# Altium schematic sheet Supply.SchDoc: Title (part 1 of 3)
size A4; Author: Adam Mizerkiewicz; CompanyName: Adam Mizerkiewicz; DrawnBy: Adam Mizerkiewicz; Engineer: Adam Mizerkiewicz; Organization: Adam Mizerkiewicz; Address1: Sarnia 2/19; Address2: 61-058 Poznań; Revision: 0.0; SheetNumber: 3; SheetTotal: 17
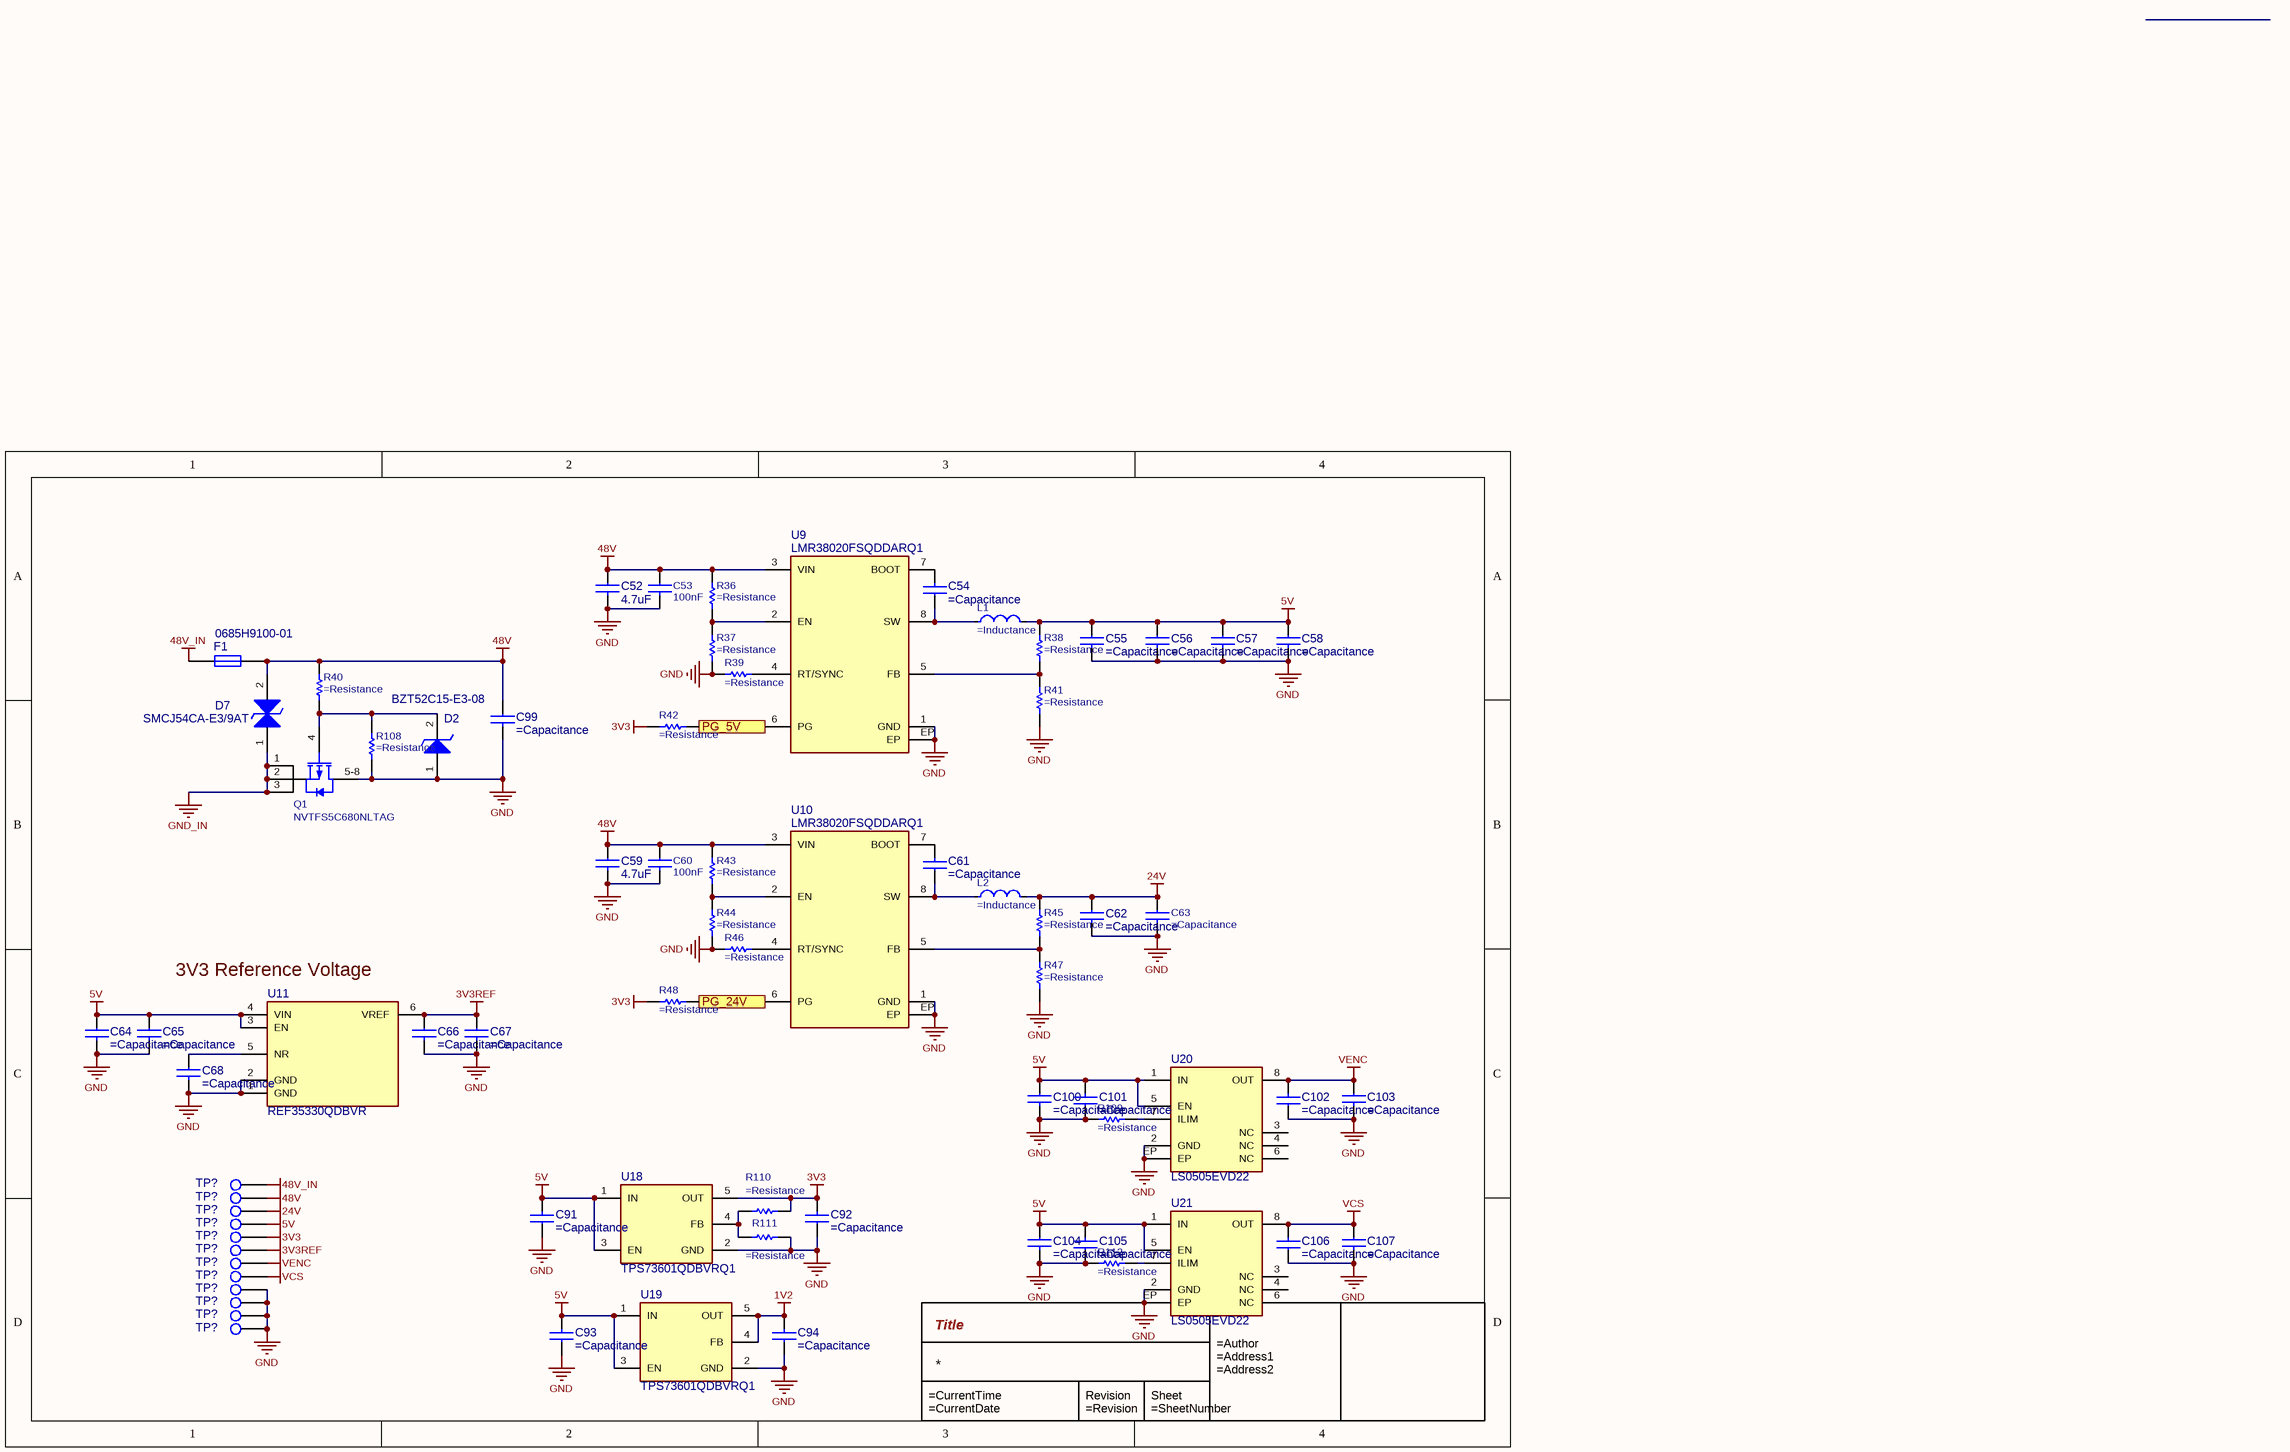
[diagram p0: Supply.SchDoc]

## Parts
(Parts that share a designator on the sheet are numbered #1, #2 ... from top to bottom, then left to right.)
C52  4.7uF  [C1206]
C53  100nF  [C0603]
C54  (no value)  [C0402]
C55  (no value)  [C0402]
C56  (no value)  [C0402]
C57  (no value)  [C0402]
C58  (no value)  [C0402]
C59  4.7uF  [C1206]
C60  100nF  [C0603]
C61  (no value)  [C0402]
C62  (no value)  [C0402]
C63  (no value)  [C0805]
C64  (no value)  [C0402]
C65  (no value)  [C0402]
C66  (no value)  [C0402]
C67  (no value)  [C0402]
C68  (no value)  [C0402]
C91  (no value)  [C0402]
C92  (no value)  [C0402]
C93  (no value)  [C0402]
C94  (no value)  [C0402]
C99  (no value)  [C1206]
C100  (no value)  [C0402]
C101  (no value)  [C0402]
C102  (no value)  [C0402]
C103  (no value)  [C0402]
C104  (no value)  [C0402]
C105  (no value)  [C0402]
C106  (no value)  [C0402]
C107  (no value)  [C0402]
D2  BZT52C15-E3-08  [SOD-123]
D7  SMCJ54CA-E3/9AT  [SMCJ_UNIPOLAR]
F1  0685H9100-01  [FUSE1206]
L1  (no value)  [ETQP4MxxxYFP]
L2  (no value)  [ETQP5MxxxYFM]
Q1  NVTFS5C680NLTAG  [WDFN8]
R36  (no value)  [R0402]
R37  (no value)  [R0402]
R38  (no value)  [R0402]
R39  (no value)  [R0402]
R40  (no value)  [R0402]
R41  (no value)  [R0402]
R42  (no value)  [R0402]
R43  (no value)  [R0402]
R44  (no value)  [R0402]
R45  (no value)  [R0402]
R46  (no value)  [R0402]
R47  (no value)  [R0402]
R48  (no value)  [R0402]
R108  (no value)  [R0402]
R109  (no value)  [R0402]
R110  (no value)  [R0402]
R111  (no value)  [R0402]
R112  (no value)  [R0402]
TP?#1  TP_SMT  [TP_SMT]  (value not drawn)  (no BOM)
TP?#2  TP_SMT  [TP_SMT]  (value not drawn)  (no BOM)
TP?#3  TP_SMT  [TP_SMT]  (value not drawn)  (no BOM)
TP?#4  TP_SMT  [TP_SMT]  (value not drawn)  (no BOM)
TP?#5  TP_SMT  [TP_SMT]  (value not drawn)  (no BOM)
TP?#6  TP_SMT  [TP_SMT]  (value not drawn)  (no BOM)
TP?#7  TP_SMT  [TP_SMT]  (value not drawn)  (no BOM)
TP?#8  TP_SMT  [TP_SMT]  (value not drawn)  (no BOM)
TP?#9  TP_SMT  [TP_SMT]  (value not drawn)  (no BOM)
TP?#10  TP_SMT  [TP_SMT]  (value not drawn)  (no BOM)
TP?#11  TP_SMT  [TP_SMT]  (value not drawn)  (no BOM)
TP?#12  TP_SMT  [TP_SMT]  (value not drawn)  (no BOM)
U9  LMR38020FSQDDARQ1  [SOIC8_PAD]
U10  LMR38020FSQDDARQ1  [SOIC8_PAD]
U11  REF35330QDBVR  [SOT-23-6]
U18  TPS73601QDBVRQ1  [SOT-23-5]
U19  TPS73601QDBVRQ1  [SOT-23-5]
U20  LS0505EVD22  [DFN2x2_8L]
U21  LS0505EVD22  [DFN2x2_8L]

## Ports
PG_5V (out), PG_24V (out)

## Nets
1V2: C94.2 U19.4(FB) U19.5(OUT)
3V3: C92.2 R42.2 R48.2 R110.2 TP?#5.1 U18.5(OUT)
3V3REF: C66.1 C67.1 TP?#6.1 U11.6(VREF)
5V: C55.1 C56.1 C57.1 C58.1 C64.1 C65.1 C91.2 C93.2 C100.1 C101.2 C104.1 C105.2 L1.2 R38.2 TP?#4.1 U11.3(EN) U11.4(VIN) U18.1(IN) U18.3(EN) U19.1(IN) U19.3(EN) U20.1(IN) U20.5(EN) U21.1(IN) U21.5(EN)
24V: C62.1 C63.1 L2.2 R45.2 TP?#3.1
48V: C52.1 C53.1 C59.1 C60.1 C99.1 D7.2 F1.1 R36.2 R40.2 R43.2 TP?#2.1 U9.3(VIN) U10.3(VIN)
48V_IN: F1.2 TP?#1.1
GND: C52.2 C53.2 C55.2 C56.2 C57.2 C58.2 C59.2 C60.2 C62.2 C63.2 C64.2 C65.2 C66.2 C67.2 C68.2 C91.1 C92.1 C93.1 C94.1 C99.2 C100.2 C101.1 C102.1 C103.2 C104.2 C105.1 C106.1 C107.2 D2.1 Q1.5-8(D) R37.1 R39.1 R41.1 R44.1 R46.1 R47.1 R108.1 R109.1 R111.2 R112.1 TP?#9.1 TP?#10.1 TP?#11.1 TP?#12.1 U9.1(GND) U9.EP U10.1(GND) U10.EP U11.1(GND) U11.2(GND) U18.2(GND) U19.2(GND) U20.2(GND) U20.EP U21.2(GND) U21.EP
GND_IN: D7.1 Q1.1(S) Q1.2(S) Q1.3(S)
VCS: C106.2 C107.1 TP?#8.1 U21.8(OUT)
VENC: C102.2 C103.1 TP?#7.1 U20.8(OUT)
PG_5V: R42.1 U9.6(PG) ; port PG_5V
PG_24V: R48.1 U10.6(PG) ; port PG_24V
NetC54_1: C54.1 L1.1 U9.8(SW)
NetC54_2: C54.2 U9.7(BOOT)
NetC61_1: C61.1 L2.1 U10.8(SW)
NetC61_2: C61.2 U10.7(BOOT)
NetC68_1: C68.1 U11.5(NR)
NetD2_2: D2.2 Q1.4(G) R40.1 R108.2
NetR36_1: R36.1 R37.2 U9.2(EN)
NetR38_1: R38.1 R41.2 U9.5(FB)
NetR39_2: R39.2 U9.4(RT/SYNC)
NetR43_1: R43.1 R44.2 U10.2(EN)
NetR45_1: R45.1 R47.2 U10.5(FB)
NetR46_2: R46.2 U10.4(RT/SYNC)
NetR109_2: R109.2 U20.7(ILIM)
NetR110_1: R110.1 R111.1 U18.4(FB)
NetR112_2: R112.2 U21.7(ILIM)

Not connected (* = marked no-connect by the designer): U20 3(NC) 4(NC) 6(NC); U21 3(NC) 4(NC) 6(NC)

## Notes on the sheet
- 3V3 Reference Voltage
- Revision
  =Revision
- Sheet
  =SheetNumber / =SheetTotal